# Altium schematic sheet Filtre_PWM60Hz.SchDoc: Differential Signal Generator - 60 Hz PWM Filter
size A4; Author: Philippe Groulx-Létourneau; DrawnBy: Philippe Groulx-Létourneau; SheetNumber: 2; SheetTotal: 4; SPICEModelCacheLZUXPCKQ: <root> / <DocumentId>LZUXPCKQ</DocumentId> / </root>
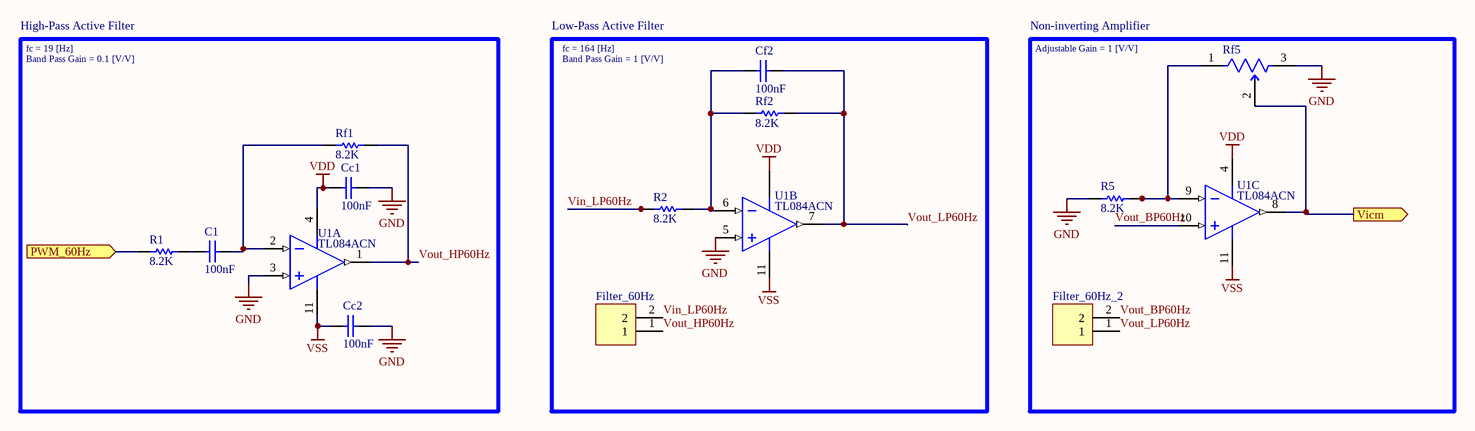
[diagram p0: Filtre_PWM60Hz.SchDoc]

## Parts
C1  value 100nF  [condensateur 0.1uf 100mil]  (hidden comment: Cap)
Cc1  value 100nF  [condensateur 0.1uf 100mil]  (hidden comment: Cap)
Cc2  value 100nF  [condensateur 0.1uf 100mil]  (hidden comment: Cap)
Cf2  value 100nF  [condensateur 0.1uf 100mil]  (hidden comment: Cap)
Filter_60Hz  Jumper  [Header 2P 100mil]  (value not drawn)
Filter_60Hz_2  Jumper  [Header 2P 100mil]  (value not drawn)
R1  value 8.2K  [Resistor_Axial 0.4]  (hidden comment: Res1)
R2  value 8.2K  [Resistor_Axial 0.4]  (hidden comment: Res1)
R5  value 8.2K  [Resistor_Axial 0.4]  (hidden comment: Res1)
Rf1  value 8.2K  [Resistor_Axial 0.4]  (hidden comment: Res1)
Rf2  value 8.2K  [Resistor_Axial 0.4]  (hidden comment: Res1)
Rf5  67WR100KLF  [FP-67W-MFG]  (value not drawn)
U1  TL084ACN  [N0014A]  (parts A,B,C of 4)

## Blocks framed on the sheet
High-Pass Active Filter: C1 Cc1 Cc2 R1 Rf1 U1
Low-Pass Active Filter: Cf2 Filter_60Hz R2 Rf2 U1
Non-inverting Amplifier: Filter_60Hz_2 R5 Rf5 U1

## Ports
PWM_60Hz (in, see Generator_main[1B]), Vicm (out, see Differential_Noise_Generator[2B])

## Nets
GND: Cc1.2 Cc2.2 R5.1 Rf5.3 U1.3(IN1+) U1.5(IN2+)
VDD: Cc1.1 U1.4(VCC+)
VSS: Cc2.1 U1.11(VCC-)
PWM_60Hz: R1.1 ; port PWM_60Hz
Vicm: Rf5.2 U1.8(OUT3) ; port Vicm
Vin_LP60Hz: Filter_60Hz.2 R2.1
Vout_BP60Hz: Filter_60Hz_2.2 U1.10(IN3+)
Vout_HP60Hz: Filter_60Hz.1 Rf1.2 U1.1(OUT1)
Vout_LP60Hz: Cf2.2 Filter_60Hz_2.1 Rf2.2 U1.7(OUT2)
NetC1_1: C1.1 R1.2
NetC1_2: C1.2 Rf1.1 U1.2(IN1-)
NetCf2_1: Cf2.1 R2.2 Rf2.1 U1.6(IN2-)
NetR5_2: R5.2 Rf5.1 U1.9(IN3-)

## Notes on the sheet
- fc = 19 [Hz]
- Band Pass Gain = 0.1 [V/V]
- fc = 164 [Hz]
- Band Pass Gain = 1 [V/V]
- Adjustable Gain = 1 [V/V]

## Library data of the parts
C1 Cc1 Cc2 Cf2 = Cap: Capacitor; Published: 8-Jun-2000; LatestRevisionDate: 17-Jul-2002; LatestRevisionNote: Re-released for DXP Platform.; PackageReference: RAD-0.3; Publisher: Altium Limited; PackageDescription: Radial Cap, Thru-Hole; 2 Leads; 0.3 in Pin Spacing
Filter_60Hz Filter_60Hz_2 = header 2 pin_UL: CONN HEADER VERT 3POS 2.54MM; LatestRevisionDate: 17-Jul-2002; LatestRevisionNote: Re-released for DXP Platform.; Publisher: Altium Limited; Digikey: 732-5315-ND
R1 R2 R5 Rf1 Rf2 = Res1: Resistor; Published: 8-Jun-2000; LatestRevisionDate: 17-Jul-2002; LatestRevisionNote: Re-released for DXP Platform.; PackageReference: AXIAL-0.3; Publisher: Altium Limited; PackageDescription: Axial Device, Thru-Hole; 2 Leads; 0.3 in Pin Spacing
Rf5 = CMP-50449-000002-1: TRIMMER 100K OHM 0.5W PC PIN TOP; Power Rating: 500mW; Temperature Coefficient: 100ppm/°C; Number of Turns: 20; Voltage Rating: 200V; Resistance: 100kR; Tolerance: 10%; Radiation Hardening: No; Min Operating Temperature: -55°C; Packaging: Bulk; Depth: 4.95mm; Resistor Type: Cermet; Mount: Through Hole; Max Power Dissipation: 500mW; Package Quantity: 100; Length: 9.53mm; REACH SVHC: No SVHC; Voltage Rating (DC): 200V; Series: 67; Height: 0.409inch; Type: Potentiometer; Weight: 1.1g; RoHS Compliant: Yes; Technology: CERMET; Lead Free: Lead Free; Termination: Pin; Resistance Tolerance: 10%; Max Operating Temperature: 125°C; Military Standard: Not
U1 = CMP-0017-00814-2: JFET-Input Operational Amplifier, 7 to 36 V, 0 to 70 degC, 14-pin DIP (N14), Pb-Free (RoHS); Manufacturer: Texas Instruments; Sub Family: General Purpose Amplifier, High Supply Voltage Amplifier (>=30V); Slew Rate(Typ)(V/us): 13; Offset Drift(Typ)(uV/C): 18; GBW(Typ)(MHz): 3; Number of Channels: 4; Rating: Catalog; Total Supply Voltage(Max)(+5V is 5, +/-5V is 10): 36; Vio (25C)(Max)(mV): 6; IIB(Max)(pA): 200; CMRR(Min)(dB): 75; Total Supply Voltage(Min)(+5V is 5, +/-5V is 10): 7; Iq per channel(Max)(mA): 2.8; PackageReference: N0014A; ComponentLink1Description: Manufacturer URL; ComponentLink1URL: http://www.ti.com/; Code_JEDEC: MS-001; PackageVersion: 4040049/E, 12/2002; Mounting Technology: Through Hole; PackageDescription: 14-Pin Plastic In-Line, Body 19.305 x 6.35 mm, Pitch 2.54 mm; ComponentLink2URL: http://www.ti.com/lit/ds/symlink/tl084a.pdf; Vn at 1kHz(Typ)(nV/rtHz): 18; DatasheetVersion: SLOS081G; ComponentLink3Description: Package Specification; ComponentLink3URL: http://www.ti.com/lit/ml/mpdi002c/mpdi002c.pdf; PartNumber: TL084ACN; Eco-Plan: Pb-Free (RoHS); ComponentLink2Description: Datasheet